# Altium schematic sheet CAN.SchDoc
size A4
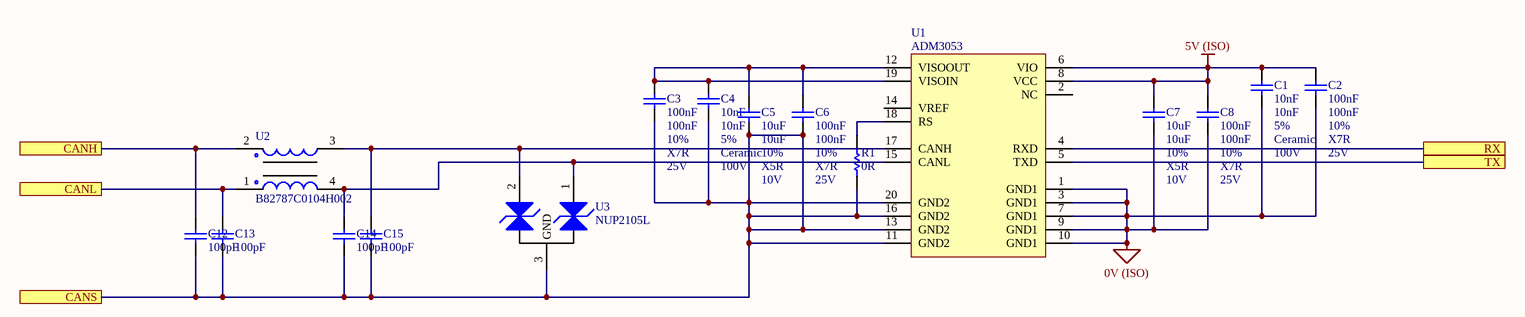
[diagram p0: CAN.SchDoc]

## Parts
C1  10nF  Tolerance: 5%  Material: Ceramic  Rated Voltage: 100V  [1206]
C2  100nF  Tolerance: 10%  Material: X7R  Rated Voltage: 25V  [0805]
C3  100nF  Tolerance: 10%  Material: X7R  Rated Voltage: 25V  [0805]
C4  10nF  Tolerance: 5%  Material: Ceramic  Rated Voltage: 100V  [1206]
C5  10uF  Tolerance: 10%  Material: X5R  Rated Voltage: 10V  [0805]
C6  100nF  Tolerance: 10%  Material: X7R  Rated Voltage: 25V  [0805]
C7  10uF  Tolerance: 10%  Material: X5R  Rated Voltage: 10V  [0805]
C8  100nF  Tolerance: 10%  Material: X7R  Rated Voltage: 25V  [0805]
C12  100pF  [0805]
C13  100pF  [0805]
C14  100pF  [0805]
C15  100pF  [0805]
R1  0R  [0805]
U1  ADM3053  [AD SOIC-W 20]
U2  B82787C0104H002  [TDK 4-PC Pad]
U3  NUP2105L  [ON SOT-23]

## Ports
CANH, CANL, CANS, RX, TX

## Nets
0V (ISO): C1.1 C2.1 C7.1 C8.1 U1.1(GND1) U1.3(GND1) U1.7(GND1) U1.9(GND1) U1.10(GND1)
5V (ISO): C1.2 C2.2 C7.2 C8.2 U1.6(VIO) U1.8(VCC)
CANH: C12.2 U2.2 ; port CANH
CANL: C13.2 U2.1 ; port CANL
CANS: C3.1 C4.1 C5.1 C6.1 C12.1 C13.1 C14.1 C15.1 R1.1 U1.11(GND2) U1.13(GND2) U1.16(GND2) U1.20(GND2) U3.3(GND) ; port CANS
RX: U1.4(RXD) ; port RX
TX: U1.5(TXD) ; port TX
NetC3_2: C3.2 C4.2 C5.2 C6.2 U1.12(VISOOUT) U1.19(VISOIN)
NetC14_2: C14.2 U1.15(CANL) U2.4 U3.1(CAN_H)
NetC15_2: C15.2 U1.17(CANH) U2.3 U3.2(CAN_L)
NetR1_2: R1.2 U1.18(RS)

Not connected (* = marked no-connect by the designer): U1 2(NC) 14(VREF)

## Library data of the parts
C1 C4 = GCM3195C2A103JA16D: Manufacturer: muRata; Value: 10nF; Part Number: GCM3195C2A103JA16D; Digikey Part Number: 490-4978-2-ND
C2 C3 C6 C8 = GCM21BR71E104KA37L: Manufacturer: muRata; Value: 100nF; Part Number: GCM21BR71E104KA37L
C5 C7 = GCM21BR61A106KA37L: Manufacturer: muRata; Value: 10uF; Part Number: GCM21BR61A106KA37L
C12-C15 = GCM21B5C1H101JA37L: Manufacturer: muRata; Tolerance: 5%; Material: C0G; Rated Voltage: 50V; Part Number: GCM21B5C1H101JA37L; Value: 100pF
R1 = RC0805FR070RL: Manufacturer: YAGEO; Tolerance: 0.01; Rated Voltage: 0.125W; Value: 0R; Part Number: RC0805FR070RL; Material: FR-07; qty: 50
U1 = ADM3053: Isolated CAN Transceiver; Manufacturer: Analogue Devices; Part Number: ADM3053; Digikey Part Number: ADM3053BRWZ-ND; Digikey Link: https://www.digikey.com/product-detail/en/analog-devices-inc/ADM3053BRWZ/ADM3053BRWZ-ND/2709332
U2 = B82787C0104H002: Common mode choke intended for CANBUS 150mA 50V); Manufacturer: EPCOS (TDK); Part Number: B82787C0104H002; Digikey Part Number: 495-4598-2-ND; Digikey Link: https://www.digikey.com/product-detail/en/epcos-tdk/B82787C0104H002/495-4598-2-ND/3680998
U3 = NUP2105L: Dual Line CAN Bus Protector; Manufacturer: ON Semiconductor; Part Number: NUP2105L; Type: CAN ESD Protection; Digikey Part Number: NUP2105LT1GOSCT-ND; Digikey Link: https://www.digikey.com/product-detail/en/on-semiconductor/NUP2105LT1G/NUP2105LT1GOSCT-ND/1485001